# Altium project firmware_board.PrjPcb
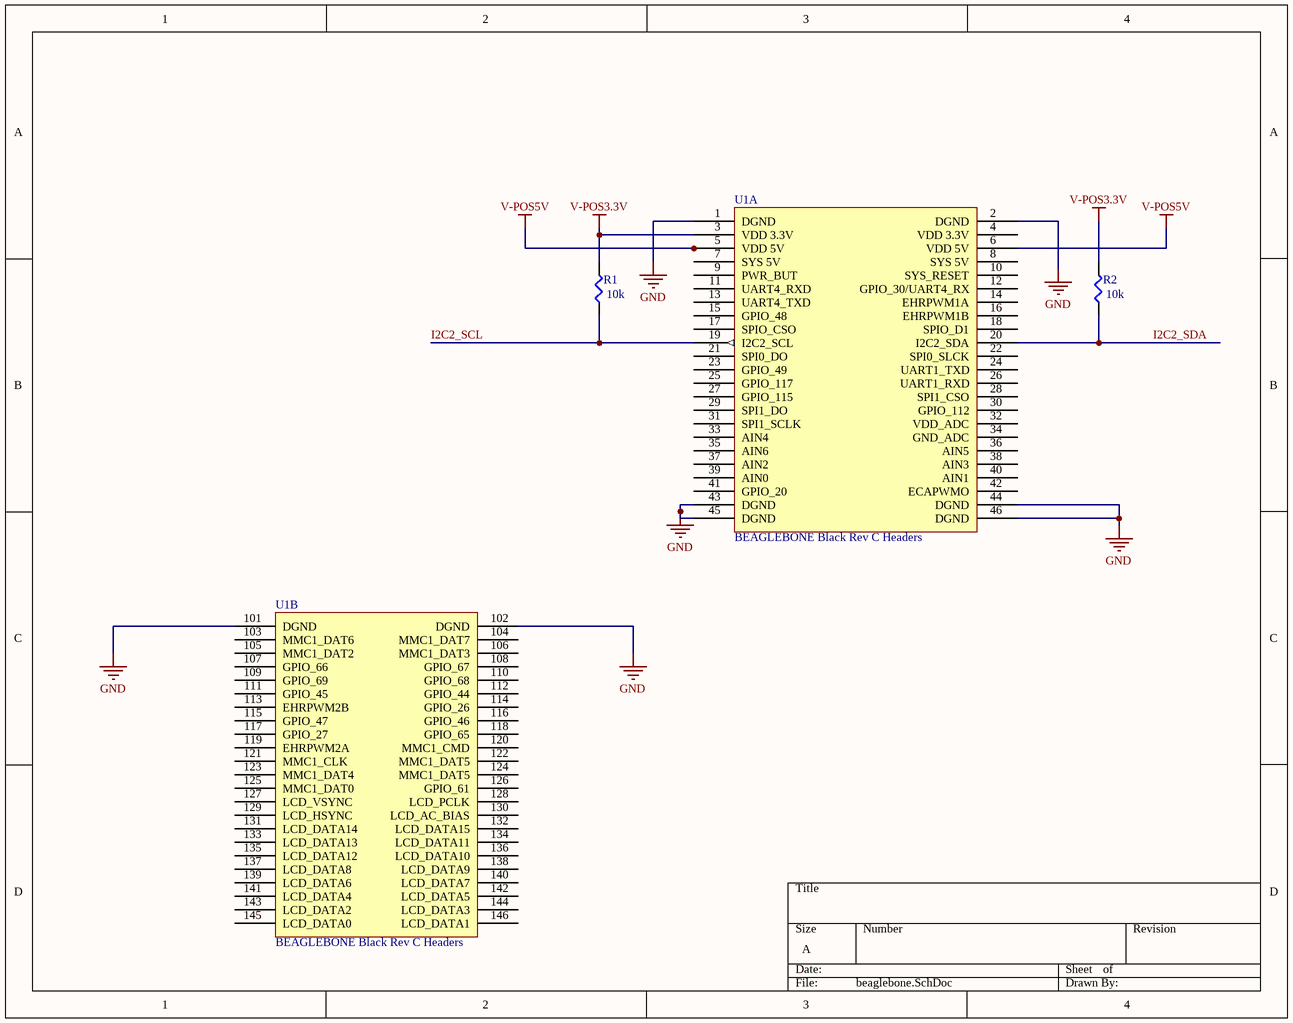
[diagram p0: beaglebone.SchDoc]
4 sheets, 12 parts. Net scope: global (net labels, ports and power ports of the same name join across sheets).
Board file: firmware_board.PcbDoc
Sheets:
  beaglebone.SchDoc
  iox.SchDoc
  interface.SchDoc
  headers.SchDoc

## Sheet beaglebone.SchDoc
size A; SheetNumber: 1; SheetTotal: 3

### Parts
R1  10k  [SMD-0805-RES]
R2  10k  [SMD-0805-RES]
U1  BEAGLEBONE Black Rev C Headers  [Beaglebone_Topside]  (parts A,B of 2)

### Nets
GND: U1.1(DGND) U1.2(DGND) U1.43(DGND) U1.44(DGND) U1.45(DGND) U1.46(DGND) U1.101(DGND) U1.102(DGND)
V-POS3.3V: R1.2 R2.2 U1.3(VDD_3.3V)
V-POS5V: U1.5(VDD_5V) U1.6(VDD_5V)
I2C2_SCL: R1.1 U1.19(I2C2_SCL)
I2C2_SDA: R2.1 U1.20(I2C2_SDA)

Not connected (* = marked no-connect by the designer): U1 4(VDD_3.3V) 7(SYS_5V) 8(SYS_5V) 9(PWR_BUT) 10(SYS_RESET) 11(UART4_RXD) 12(GPIO_30/UART4_RX) 13(UART4_TXD) 14(EHRPWM1A) 15(GPIO_48) 16(EHRPWM1B) 17(SPIO_CSO) 18(SPIO_D1) 21(SPI0_DO) 22(SPI0_SLCK) 23(GPIO_49) 24(UART1_TXD) 25(GPIO_117) 26(UART1_RXD) 27(GPIO_115) 28(SPI1_CSO) 29(SPI1_DO) 30(GPIO_112) 31(SPI1_SCLK) 32(VDD_ADC) 33(AIN4) 34(GND_ADC) 35(AIN6) 36(AIN5) 37(AIN2) 38(AIN3) 39(AIN0) 40(AIN1) 41(GPIO_20) 42(ECAPWMO) 103(MMC1_DAT6) 104(MMC1_DAT7) 105(MMC1_DAT2) 106(MMC1_DAT3) 107(GPIO_66) 108(GPIO_67) 109(GPIO_69) 110(GPIO_68) 111(GPIO_45) 112(GPIO_44) 113(EHRPWM2B) 114(GPIO_26) 115(GPIO_47) 116(GPIO_46) 117(GPIO_27) 118(GPIO_65) 119(EHRPWM2A) 120(MMC1_CMD) 121(MMC1_CLK) 122(MMC1_DAT5) 123(MMC1_DAT4) 124(MMC1_DAT5) 125(MMC1_DAT0) 126(GPIO_61) 127(LCD_VSYNC) 128(LCD_PCLK) 129(LCD_HSYNC) 130(LCD_AC_BIAS) 131(LCD_DATA14) 132(LCD_DATA15) 133(LCD_DATA13) 134(LCD_DATA11) 135(LCD_DATA12) 136(LCD_DATA10) 137(LCD_DATA8) 138(LCD_DATA9) 139(LCD_DATA6) 140(LCD_DATA7) 141(LCD_DATA4) 142(LCD_DATA5) 143(LCD_DATA2) 144(LCD_DATA3) 145(LCD_DATA0) 146(LCD_DATA1)

### Library data of the parts
R1 R2 = ERJ-6ENF1002V: RES SMD 10K OHM 1% 1/8W 0805; Manufacturer: Panasonic Electronic Components; Factory Stock: 0; Unit Price (USD): 0.00729; @ qty: 1500; Minimum Quantity: 1; Power (Watts): 0.125W, 1/8W; Temperature Coefficient: ±100ppm/°C; Part Number: ERJ-6ENF1002V; Datasheets: http://industrial.panasonic.com/www-cgi/jvcr13pz.cgi?E+PZ+3+AOA0002+ERJ6ENF1002V+7+WW; Image: //media.digikey.com/Renders/Panasonic%20Renders/ERJ-0805%20Pkg.jpg; Digi-Key Part Number: P10.0KCCT-ND; Quantity Available: 3985614; Packaging: Cut Tape (CT); Series: ERJ; Part Status: Active; Value: 10k; Tolerance: ±1%; Composition: Thick Film; Features: Automotive AEC-Q200; Operating Temperature: -55°C ~ 155°C; Package / Case: 0805 (2012 Metric); Supplier Device Package: 0805; Size / Dimension: 0.079" L x 0.049" W (2.00mm x 1.25mm); Height - Seated (Max): 0.028" (0.70mm); Number of Terminations: 2; Failure Rate: -
U1 = Beaglebone: KIT DEV BEAGLEBONE BLACK REV C. Header Breakout; Manufactuer: Beaglebone; Manufacturer P/N: Beaglebone Black REV C; Digikey P/N: BBB01-SC-505-ND; Digikey Link: https://www.digikey.com/product-detail/en/ghi-electronics-llc/BBB01-SC-505/BBB01-SC-505-ND/6210999; Datasheet: https://media.digikey.com/pdf/Data%20Sheets/Circuitco%20Elect/BB-BBLK-000%20Manual.pdf; ComponentLink1Description: Digikey; ComponentLink1URL: https://www.digikey.com/product-detail/en/ghi-electronics-llc/BBB01-SC-505/BBB01-SC-505-ND/6210999

## Sheet iox.SchDoc
size A; SheetNumber: 2; SheetTotal: 3
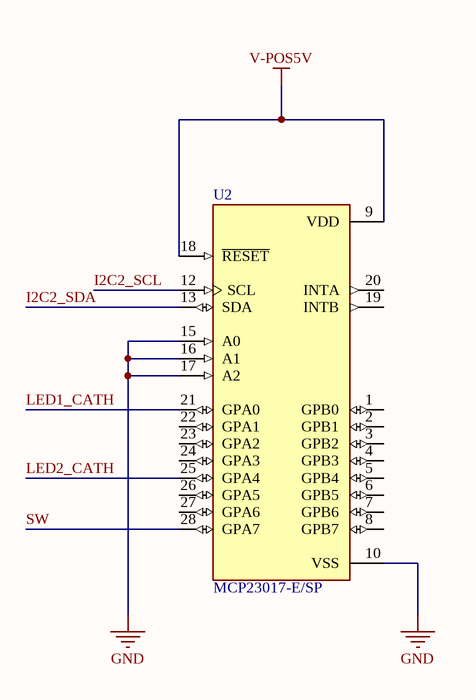
[diagram p1: iox.SchDoc]

### Parts
U2  MCP23017-E/SP  [DIP787W45P254L3556H508Q28]

### Nets
GND: U2.10(VSS) U2.15(A0) U2.16(A1) U2.17(A2)
V-POS5V: U2.9(VDD) U2.18(~{RESET})
I2C2_SCL: U2.12(SCL)
I2C2_SDA: U2.13(SDA)
LED1_CATH: U2.21(GPA0)
LED2_CATH: U2.25(GPA4)
SW: U2.28(GPA7)

Not connected (* = marked no-connect by the designer): U2 1(GPB0) 2(GPB1) 3(GPB2) 4(GPB3) 5(GPB4) 6(GPB5) 7(GPB6) 8(GPB7) 19(INTB) 20(INTA) 22(GPA1) 23(GPA2) 24(GPA3) 26(GPA5) 27(GPA6)

### Library data of the parts
U2 = MCP23017-E/SP: I/O Expander 16 IÂ²C 1.7MHz 28-SPDIP; MF: Microchip; Availability: Unavailable; MP: MCP23017-E/SP; Price: None; Value: *; SnapEDA_Link: https://www.snapeda.com/parts/MCP23017-E/SP/Microchip/view-part/48605/?ref=snap; Package: DIP-28 Microchip

## Sheet interface.SchDoc
size A; SheetNumber: 3; SheetTotal: 4
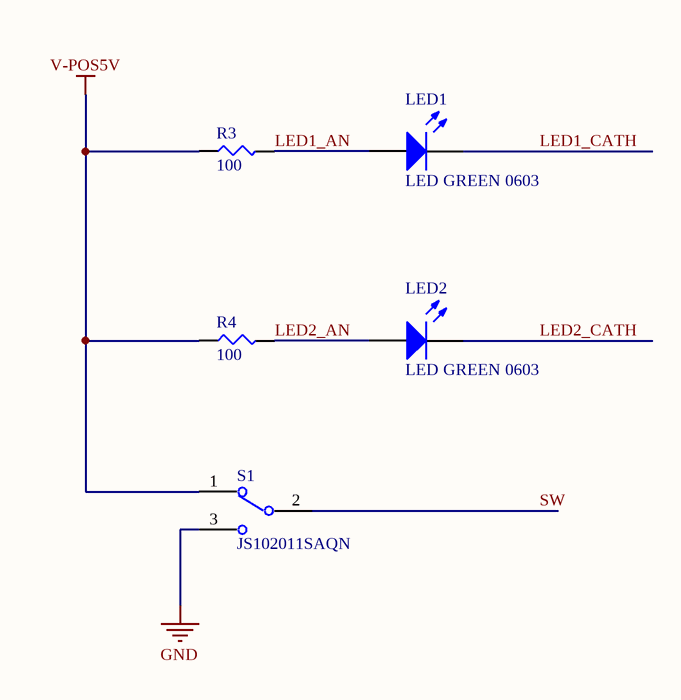
[diagram p2: interface.SchDoc]

### Parts
LED1  LED GREEN 0603  [LED 0603 GREEN]
LED2  LED GREEN 0603  [LED 0603 GREEN]
R3  100  [SMD-0805-RES]
R4  100  [SMD-0805-RES]
S1  JS102011SAQN  [SW_JS102011SAQN]

### Nets
GND: S1.3
V-POS5V: R3.1 R4.1 S1.1
LED1_AN: LED1.1(A) R3.2
LED1_CATH: LED1.2(K)
LED2_AN: LED2.1(A) R4.2
LED2_CATH: LED2.2(K)
SW: S1.2

### Library data of the parts
LED1 LED2 = LED GREEN 0603: Manufacturer: Lite-On Inc.; Manufacturer P/N: LTST-C190KGKT; Digikey P/N: 160-1435-1-ND; Package / Case: 0603; Color: GREEN
R3 R4 = ERJ-6ENF1000V: RES SMD 100 OHM 1% 1/8W 0805; Manufacturer: Panasonic Electronic Components; Factory Stock: 0; Unit Price (USD): 0.00729; @ qty: 1500; Minimum Quantity: 1; Power (Watts): 0.125W, 1/8W; Temperature Coefficient: ±100ppm/°C; Part Number: ERJ-6ENF1000V; Datasheets: http://industrial.panasonic.com/www-cgi/jvcr13pz.cgi?E+PZ+3+AOA0002+ERJ6ENF1000V+7+WW; Image: //media.digikey.com/Renders/Panasonic%20Renders/ERJ-0805%20Pkg.jpg; Digi-Key Part Number: P100CCT-ND; Quantity Available: 288663; Packaging: Cut Tape (CT); Series: ERJ; Part Status: Active; Value: 100; Tolerance: ±1%; Composition: Thick Film; Features: Automotive AEC-Q200; Operating Temperature: -55°C ~ 155°C; Package / Case: 0805 (2012 Metric); Supplier Device Package: 0805; Size / Dimension: 0.079" L x 0.049" W (2.00mm x 1.25mm); Height - Seated (Max): 0.028" (0.70mm); Number of Terminations: 2; Failure Rate: -
S1 = JS102011SAQN: Slide Switch SPDT Surface Mount, Right Angle; MF: C&K; Availability: Unavailable; Price: None; SnapEDA_Link: https://www.snapeda.com/parts/JS102011SAQN/C%26K/view-part/214325/?ref=snap; Value: *; MP: JS102011SAQN; Package: None

## Sheet headers.SchDoc
size A; SheetNumber: 4; SheetTotal: 4
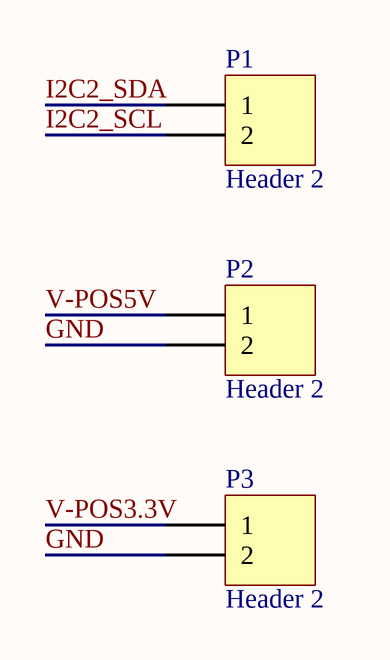
[diagram p3: headers.SchDoc]

### Parts
P1  Header 2  [Pin Header 1x2 TH Pitch 2.54mm]
P2  Header 2  [Pin Header 1x2 TH Pitch 2.54mm]
P3  Header 2  [Pin Header 1x2 TH Pitch 2.54mm]

### Nets
GND: P2.2 P3.2
V-POS3.3V: P3.1
V-POS5V: P2.1
I2C2_SCL: P1.2
I2C2_SDA: P1.1

### Library data of the parts
P1-P3 = Header 2: Header, 2-Pin; LatestRevisionDate: 17-Jul-2002; LatestRevisionNote: Re-released for DXP Platform.; Publisher: Altium Limited

## Nets that join several sheets
GND: beaglebone (8 pins), iox (U2.10 U2.15 U2.16 U2.17), interface (S1.3), headers (P2.2 P3.2)
V-POS3.3V: beaglebone (R1.2 R2.2 U1.3), headers (P3.1)
V-POS5V: beaglebone (U1.5 U1.6), iox (U2.9 U2.18), interface (R3.1 R4.1 S1.1), headers (P2.1)
I2C2_SCL: beaglebone (R1.1 U1.19), iox (U2.12), headers (P1.2)
I2C2_SDA: beaglebone (R2.1 U1.20), iox (U2.13), headers (P1.1)
LED1_CATH: iox (U2.21), interface (LED1.2)
LED2_CATH: iox (U2.25), interface (LED2.2)
SW: iox (U2.28), interface (S1.2)